# Altium project Schaltbox RemotePC_ohne_Tiny.PrjPCB
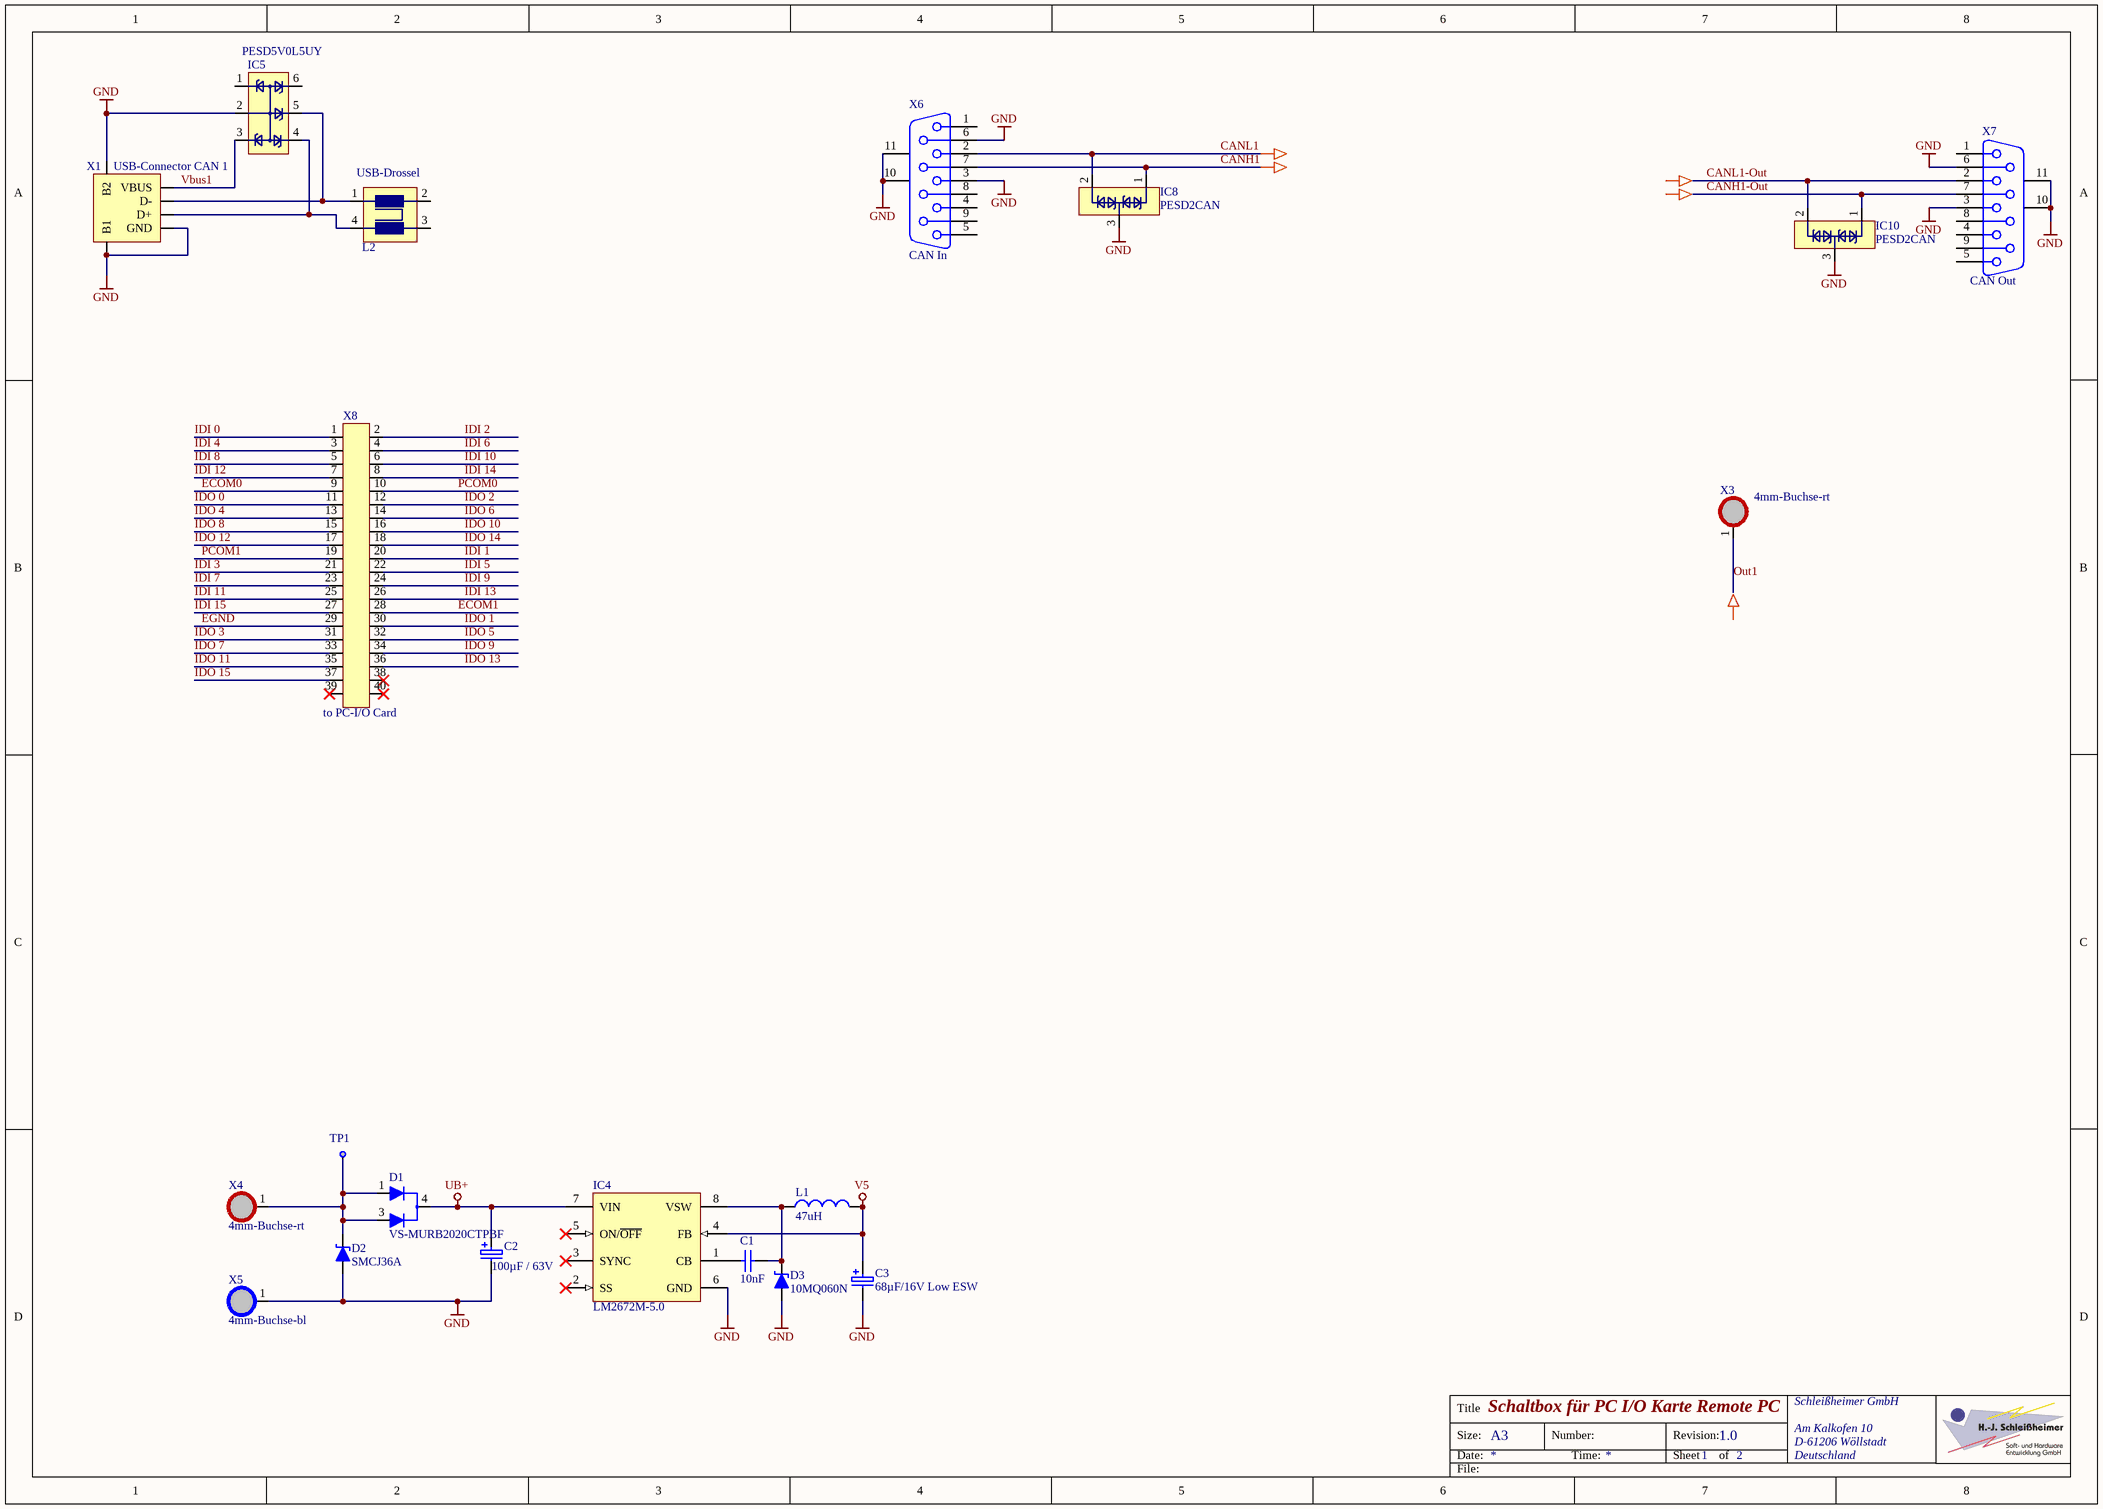
[diagram p0: Schaltbox_Power&CAN.SchDoc]
2 sheets, 49 parts. Net scope: global (net labels, ports and power ports of the same name join across sheets).
Board file: Schaltbox.PcbDoc
Sheets:
  Schaltbox_Power&CAN.SchDoc
  Schaltbox_Switch.SchDoc

## Sheet Schaltbox_Power&CAN.SchDoc: Schaltbox für PC I/O Karte Remote PC
size A3; Organization: Schleißheimer GmbH; Address2: Am Kalkofen 10; Address3: D-61206 Wöllstadt; Address4: Deutschland; Revision: 1.0; SheetNumber: 1; SheetTotal: 2; DocumentName: Schaltbox.SchDoc

### Parts
(Parts that share a designator on the sheet are numbered #1, #2 ... from top to bottom, then left to right.)
*#1  Pfeil-->  (value not drawn)  (graphical)
*#2  Pfeil-->  (value not drawn)  (graphical)
*#3  Pfeil-->  (value not drawn)  (graphical)
*#4  Pfeil-->  (value not drawn)  (graphical)
*#5  Pfeil-->  (value not drawn)  (graphical)
C1  10nF  [C0603MD]
C2  100µF / 63V  [ALU-G]
C3  68µF/16V Low ESW  [ALU-D]
D1  VS-MURB2020CTPBF  [TO252-3_LD_(DPAK)]
D2  SMCJ36A  [SMC_MD_(DO214AB)]
D3  10MQ060N  [SMA_LD_(DO214AC)]
IC4  LM2672M-5.0  [M08A_N]
IC5  PESD5V0L5UY  [SOT363_MD_(SC88 / SC70-6)]
IC8  PESD2CAN  [SOT23_MD]
IC10  PESD2CAN  [SOT23_MD]
L1  47uH  [L_B82464-G4]
L2  USB-Drossel  [Drossel-USB]
TP1  Testpoint  [TESTPAD-1.2mm]  (value not drawn)  (no BOM)
X1  USB-Connector CAN 1  [USB_TypB]
X3  4mm-Buchse-rt  [4mm-Bu_ liegend-rt]
X4  4mm-Buchse-rt  [4mm-Bu_ liegend-rt]
X5  4mm-Buchse-bl  [4mm-Bu_ liegend-sw]
X6  CAN In  [DSUB1.385-2H9]
X7  CAN Out  [DSUB1.385-2H9]
X8  to PC-I/O Card  [SchneidKlemm_40]

### Nets
GND: C2.N C3.N D2.2 D3.2(A) IC4.6(GND) IC5.2 IC8.3 IC10.3 X1.B1 X1.B2 X1.GND X5.1 X6.3 X6.6 X6.10(MH1) X6.11(MH2) X7.3 X7.6 X7.10(MH1) X7.11(MH2)
UB+: C2.P D1.4(K) IC4.7(VIN)
V5: C3.P IC4.4(FB) L1.2
CANH1: IC8.1 X6.7
CANH1-Out: IC10.1 X7.7
CANL1: IC8.2 X6.2
CANL1-Out: IC10.2 X7.2
ECOM0: X8.9
ECOM1: X8.28
EGND: X8.29
IDI 0: X8.1
IDI 1: X8.20
IDI 2: X8.2
IDI 3: X8.21
IDI 4: X8.3
IDI 5: X8.22
IDI 6: X8.4
IDI 7: X8.23
IDI 8: X8.5
IDI 9: X8.24
IDI 10: X8.6
IDI 11: X8.25
IDI 12: X8.7
IDI 13: X8.26
IDI 14: X8.8
IDI 15: X8.27
IDO 0: X8.11
IDO 1: X8.30
IDO 2: X8.12
IDO 3: X8.31
IDO 4: X8.13
IDO 5: X8.32
IDO 6: X8.14
IDO 7: X8.33
IDO 8: X8.15
IDO 9: X8.34
IDO 10: X8.16
IDO 11: X8.35
IDO 12: X8.17
IDO 13: X8.36
IDO 14: X8.18
IDO 15: X8.37
Out1: X3.1
PCOM0: X8.10
PCOM1: X8.19
Vbus1: IC5.3 X1.VBUS
NetC1_1: C1.1 D3.1(K) IC4.8(VSW) L1.1
NetC1_2: C1.2 IC4.1(CB)
NetD1_1: D1.1(A1) D1.3(A2) D2.1 TP1.1(tp) X4.1
NetIC5_4: IC5.4 L2.4(I_2) X1.D+
NetIC5_5: IC5.5 L2.1(I_1) X1.D-

Not connected (* = marked no-connect by the designer): IC4 2(SS)* 3(SYNC)* 5(ON/~{OFF})*; IC5 1 6; L2 2(O_1) 3(O_2); X6 1 4 5 8 9; X7 1 4 5 8 9; X8 38* 39* 40*

### Notes on the sheet
- Title
- Size:
- Date:
- A3
- Number:
- Time:
- Revision:
- Sheet
- of
- File:

### Library data of the parts
*#1-*#5 = Pfeil-->: No Footprint
C1 = Cap: Capacitor; Published: 8-Jun-2000; LatestRevisionDate: 17-Jul-2002; LatestRevisionNote: Re-released for DXP Platform.; PackageReference: RAD-0.3; Publisher: Altium Limited; Value: 10nF
C2 C3 = Cap Pol: Capacitor Polarized; Published: 8-Jun-2000; LatestRevisionDate: 17-Jul-2002; LatestRevisionNote: Re-released for DXP Platform.; PackageReference: C0805; Publisher: Altium Limited
  C2: Value: 100µF / 63V
  C3: Value: 68µF/16V Low ESW
D1 = MURD620CT: Schottky Barrier Double Diode; Published: 17-Sep-2003; LatestRevisionDate: 12-Dec-2006; LatestRevisionNote: IPC-7351 Footprint Added.; DatasheetVersion: 4-Mar-2002; PackageVersion: May-1999; PackageReference: SOT23; Publisher: Altium Limited; PackageDescription: 3-Pin SOT-23 Package 0.95 mm Pitch, 2.3 mm Lead Span; ComponentLink1Description: Manufacturer Link; ComponentLink1URL: http://www.semiconductors.philips.com/; ComponentLink2Description: Datasheet; ComponentLink2URL: http://www.semiconductors.philips.com/acrobat/datasheets/BAT54_SERIES_4.pdf
D2 = SMCJ36A: Suppressor Diode, unidirektional, 36V, 1500 W, fFotprint SMC
D3 = 10MQ060NPbF: Schotky Diode 2,1A 60V, footprint SMA
IC4 = LM2672M-5.0: SIMPLE SWITCHER® Power Converter High Efficiency 1A Step-Down Voltage Regulator with Features, 8-pin Narrow SOIC; Manufacturer: National Semiconductor; PackageTopMarking: NSZXTT*2672*M5.0; PowerWise: N; Published: 4-Dec-2008; DatasheetVersion: Apr-2007; PackageVersion: revM, May-2009; PackageReference: M08A; Publisher: Altium Limited; PackageDescription: SOIC Narrow, 4.9 x 3.9 x 1.45mm, 8 Lead, 1.27mm Pitch; Supplier 1: Farnell; Supplier Part Number 1: 9489797; PartNumber: LM2672M-5.0; RoHS: N; PinCount: 8; CompType: Switcher; Code_JEDEC: MS-012-AA; Code_IPC: SOIC127P600-8; ComponentLink1Description: LM2672 Datasheet; ComponentLink1URL: http://www.national.com/ds/LM/LM2672.pdf; ComponentLink2Description: LM2672 Web Page; ComponentLink2URL: http://www.national.com/pf/LM/LM2672.html; ComponentLink3Description: M08A Package Page; ComponentLink3URL: http://www.national.com/packaging/folders/m08a.html
IC5 = PESD5V0L5UY: ESD_Protection 5 Lines
IC8 IC10 = PESD2CAN: ESD-Protection CAN-Bus
L1 = Inductor: Code_IEC: 1005; Published: 8-Jun-2000; LatestRevisionDate: 17-Jul-2002; LatestRevisionNote: Re-released for DXP Platform.; PackageReference: 0402-A; Publisher: Altium Limited; Code_JEITA: 0402; Value: 47uH
L2 = USB-Drossel: USB 2.0-Drossel, Commen-Mode Noise Supressor
X1 = USB-Typ AB: USB-Stecker-Typ A und B,THT
X3 X4 = 4mm-Buchse-rt: Bananen-Stecker 4mm
X5 = 4mm-Buchse-bl: Bananen-Stecker 4mm
X6 X7 = D Connector 9: Receptacle Assembly, 9 Position, Right Angle; PackageDocument: O; Positions: 9; Published: 15-Jun-2001; LatestRevisionDate: 17-Jul-2002; LatestRevisionNote: Re-released for DXP Platform.; DatasheetDocument: 1-Sep-1999; PackageReference: 788750; Publisher: Altium Limited; Orientation: Right Angle; Gender: Receptacle
X8 = CON-40pol: Schneid-Klemm-Verbinder 40pol

## Sheet Schaltbox_Switch.SchDoc: Schaltbox für PC I/O - Switches
size A3; Organization: Schleißheimer GmbH; Address2: Am Kalkofen 10; Address3: D-61206 Wöllstadt; Address4: Deutschland; Revision: 1.0; SheetNumber: 2; SheetTotal: 2; PageSetup: Record=PageOptions|CenterHorizontal=True|CenterVertical=True|PrintScale=0.70|XCorrection=1.00|YCorrection=1.00|PrintKind=0|BorderSize=5000000|LeftOffset=0|BottomOffset=0|Orientation=2|PaperLength=1000|PaperWidth=1000|Scale=100|PaperSource=7|PrintQuality=-4|MediaType=1|DitherType=10|PrintScaleMode=1|PaperKind=A4|PaperIndex=9; ProjectName: Remote AP
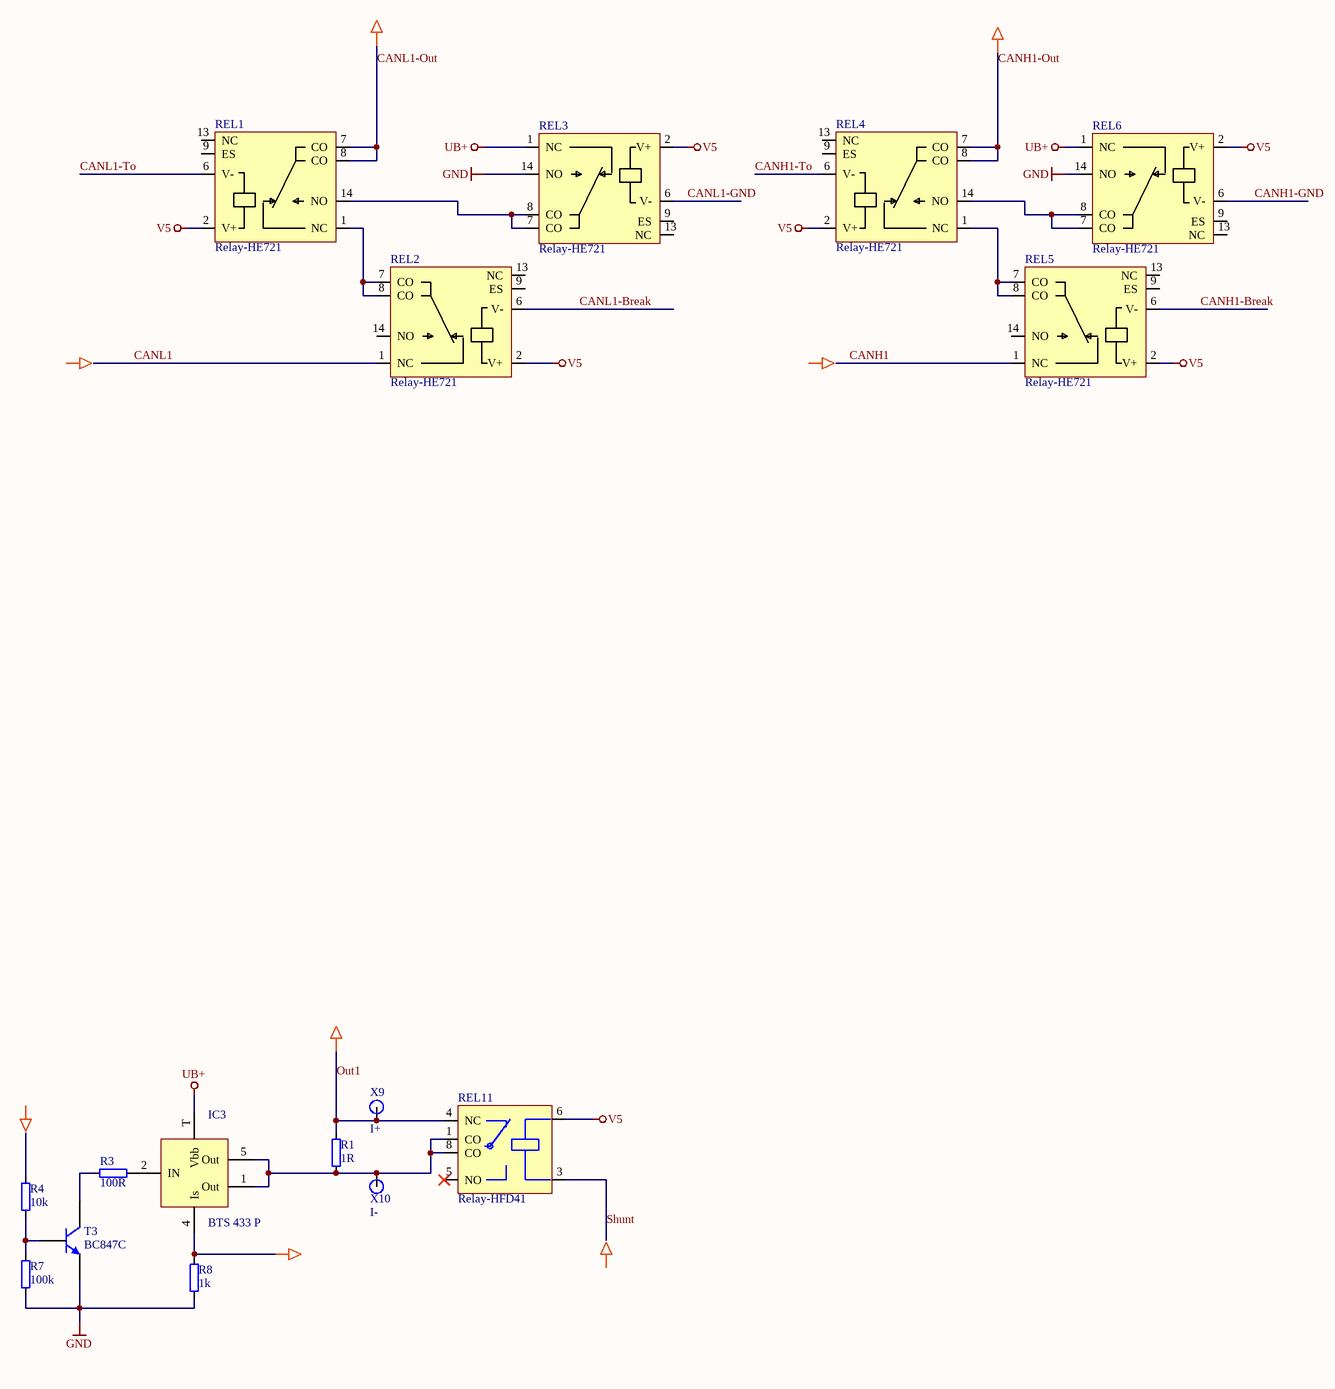
[diagram p1: Schaltbox_Switch.SchDoc]

### Parts
(Parts that share a designator on the sheet are numbered #1, #2 ... from top to bottom, then left to right.)
*#6  Pfeil-->  (value not drawn)  (graphical)
*#7  Pfeil-->  (value not drawn)  (graphical)
*#8  Pfeil-->  (value not drawn)  (graphical)
*#9  Pfeil-->  (value not drawn)  (graphical)
*#10  Pfeil-->  (value not drawn)  (graphical)
*#11  Pfeil-->  (value not drawn)  (graphical)
*#12  Pfeil-->  (value not drawn)  (graphical)
*#13  Pfeil-->  (value not drawn)  (graphical)
IC3  BTS 433 P  [TO252-5_MD_(DPAK)]
R1  1R  [R2512HD]
R3  100R  [R0603HD]
R4  10k  [R0603HD]
R7  100k  [R0603HD]
R8  1k  [R0603HD]
REL1  Relay-HE721  [DIP14 - HE700]
REL2  Relay-HE721  [DIP14 - HE700]
REL3  Relay-HE721  [DIP14 - HE700]
REL4  Relay-HE721  [DIP14 - HE700]
REL5  Relay-HE721  [DIP14 - HE700]
REL6  Relay-HE721  [DIP14 - HE700]
REL11  Relay-HFD41  [REL_HFD41]
T3  BC847C  [SOT23_L]
X9  I+  [Loetoese-3.2]
X10  I-  [Loetoese-3.2]

### Nets
GND: R7.1 R8.1 REL3.14(NO) REL6.14(NO) T3.2(E)
UB+: IC3.T(Vbb) REL3.1(NC) REL6.1(NC)
V5: REL1.2(V+) REL2.2(V+) REL3.2(V+) REL4.2(V+) REL5.2(V+) REL6.2(V+) REL11.6
CANH1: REL5.1(NC)
CANH1-Break: REL5.6(V-)
CANH1-GND: REL6.6(V-)
CANH1-Out: REL4.7(CO) REL4.8(CO)
CANH1-To: REL4.6(V-)
CANL1: REL2.1(NC)
CANL1-Break: REL2.6(V-)
CANL1-GND: REL3.6(V-)
CANL1-Out: REL1.7(CO) REL1.8(CO)
CANL1-To: REL1.6(V-)
Out1: R1.2 REL11.4(NC) X9.1
Shunt: REL11.3
NetIC3_1: IC3.1(Out) IC3.5(Out) R1.1 REL11.1(CO) REL11.8(CO) X10.1
NetIC3_2: IC3.2(IN) R3.1
NetIC3_4: IC3.4(Is) R8.2
NetR3_2: R3.2 T3.3(C)
NetR4_1: R4.1 R7.2 T3.1(B)
NetREL1_1: REL1.1(NC) REL2.7(CO) REL2.8(CO)
NetREL1_14: REL1.14(NO) REL3.7(CO) REL3.8(CO)
NetREL4_1: REL4.1(NC) REL5.7(CO) REL5.8(CO)
NetREL4_14: REL4.14(NO) REL6.7(CO) REL6.8(CO)

Not connected (* = marked no-connect by the designer): R4 2; REL1 9(ES) 13(NC); REL2 9(ES) 13(NC) 14(NO); REL3 9(ES) 13(NC); REL4 9(ES) 13(NC); REL5 9(ES) 13(NC) 14(NO); REL6 9(ES) 13(NC); REL11 5(NO)*

### Notes on the sheet
- Title
- Size:
- Date:
- A3
- Number:
- Time:
- Revision:
- Sheet
- of
- File:

### Library data of the parts
*#6-*#13 = Pfeil-->: No Footprint
IC3 = BTS443 P
R1 R3 R4 R7 R8 = Res: Resistor
  R3: VALUE: 100R
  R4: VALUE: 10k
  R7: VALUE: 100k
  R8: VALUE: 1k
REL1-REL6 = Relay-HE721: Hamlin Reed-Relay SPDT
REL11 = Relay-HFD41: Relay Hongfa Typ HFD41, SPDT, 2A/ 250VAC/30VDC
T3 = BC847C: NPN General-purpose Transistor; Published: 17-Sep-2003; LatestRevisionDate: 12-Dec-2006; LatestRevisionNote: IPC-7351 Footprint Added.; DatasheetVersion: 4-Feb-2002; PackageVersion: May-1999; PackageReference: SOT23; Publisher: Altium Limited; PackageDescription: 3-Pin SOT-23 Package 0.95 mm Pitch, 2.3 mm Lead Span; ComponentLink1Description: Manufacturer Link; ComponentLink1URL: http://www.semiconductors.philips.com/; ComponentLink2Description: Datasheet; ComponentLink2URL: http://www.semiconductors.philips.com/acrobat/datasheets/BC846_BC847_BC848_5.pdf
X9 X10 = Anschlusspin: Anschluss, Bohrung 1.2mm

## Nets that join several sheets
GND: Schaltbox_Power&CAN (20 pins), Schaltbox_Switch (5 pins)
UB+: Schaltbox_Power&CAN (C2.P D1.4 IC4.7), Schaltbox_Switch (IC3.T REL3.1 REL6.1)
V5: Schaltbox_Power&CAN (C3.P IC4.4 L1.2), Schaltbox_Switch (7 pins)
CANH1: Schaltbox_Power&CAN (IC8.1 X6.7), Schaltbox_Switch (REL5.1)
CANH1-Out: Schaltbox_Power&CAN (IC10.1 X7.7), Schaltbox_Switch (REL4.7 REL4.8)
CANL1: Schaltbox_Power&CAN (IC8.2 X6.2), Schaltbox_Switch (REL2.1)
CANL1-Out: Schaltbox_Power&CAN (IC10.2 X7.2), Schaltbox_Switch (REL1.7 REL1.8)
Out1: Schaltbox_Power&CAN (X3.1), Schaltbox_Switch (R1.2 REL11.4 X9.1)